# EAGLE design SparkFun_Serial_DB9-Breakout-v13 (EAGLE 7.2.0)
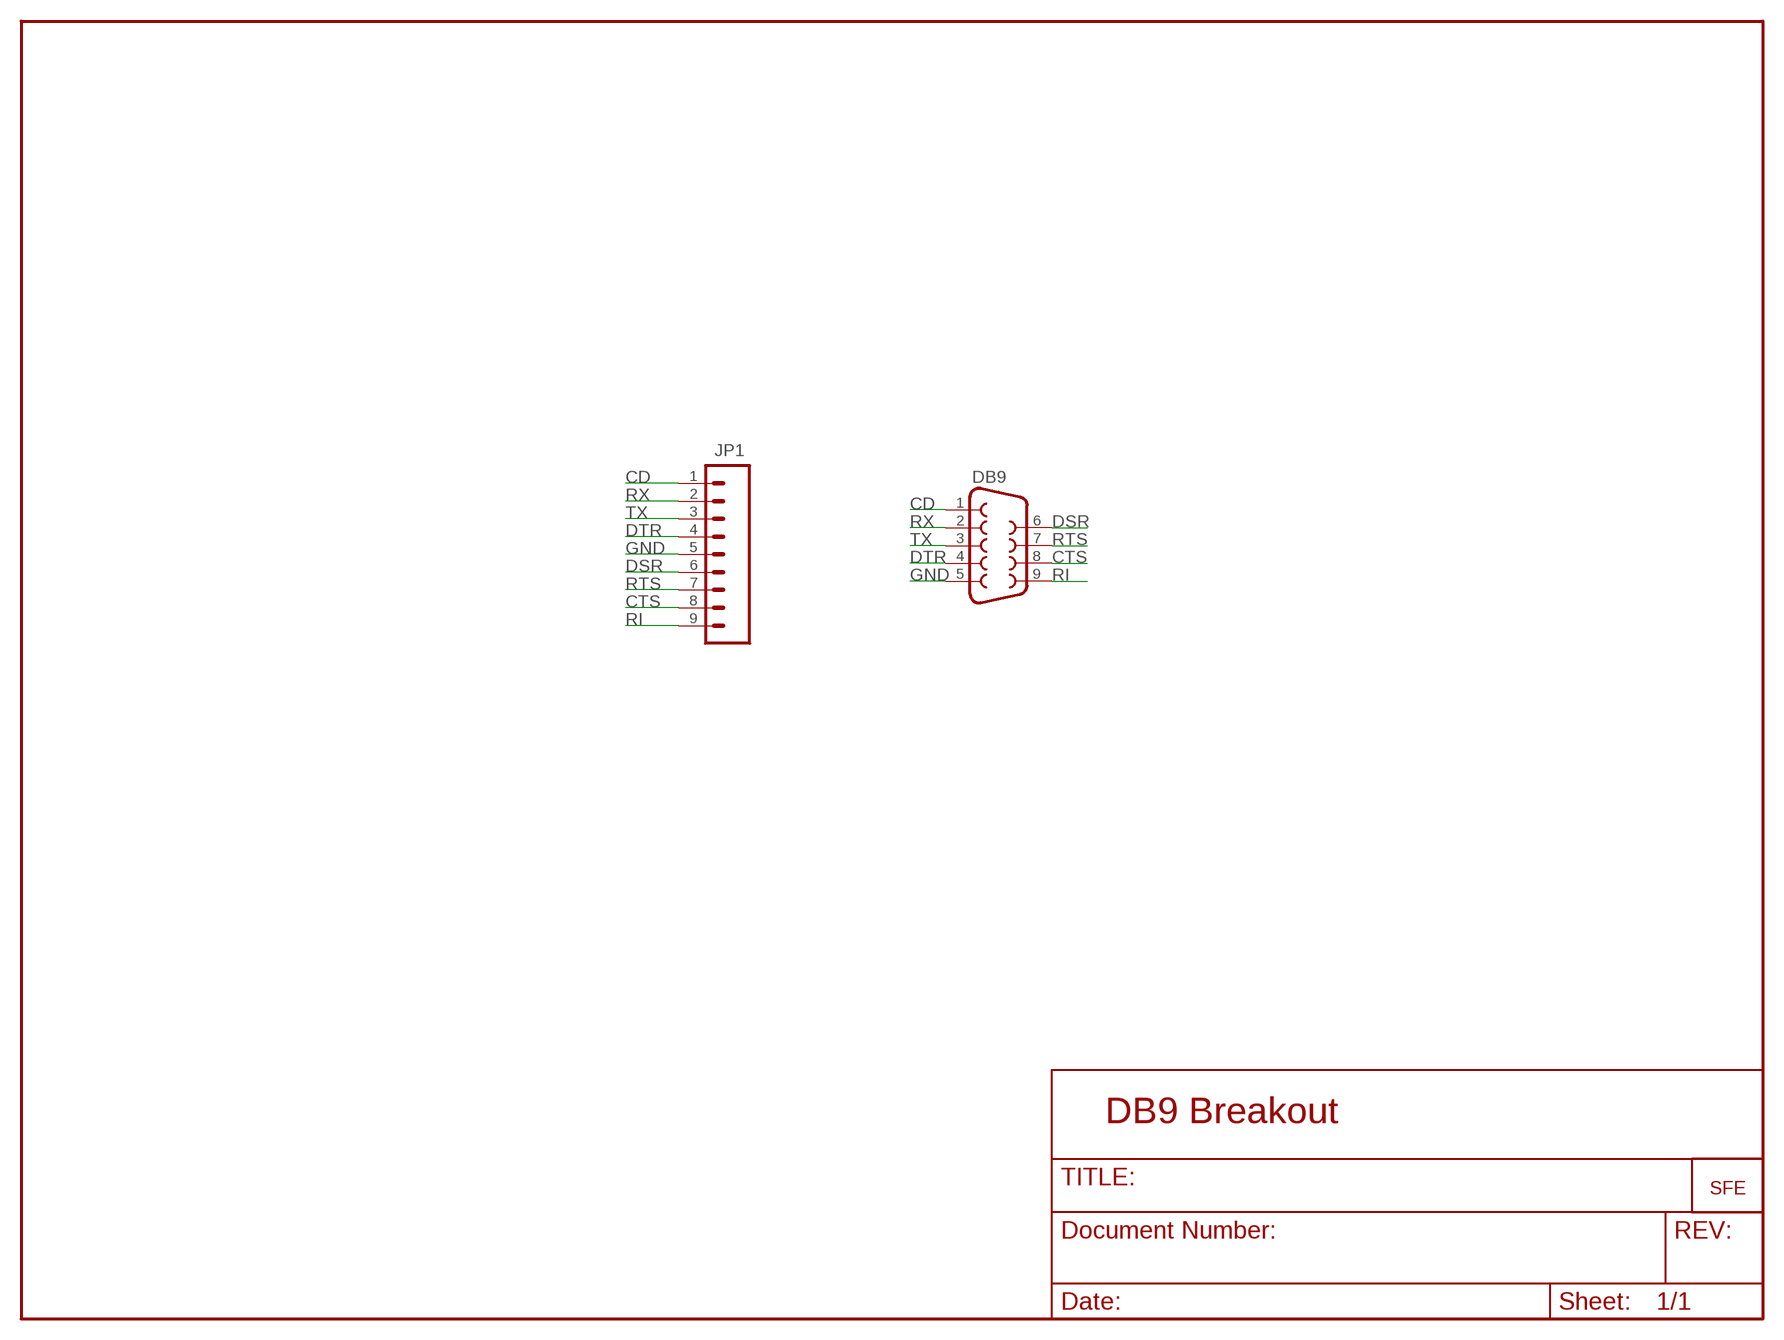
[diagram p0: schematic, sheet 1]

## Parts
DB9  DB9  [DB9]
JP1  M09  [1X09]
U$2  LOGO-SFENEW  [SFE-NEW-WEBLOGO]

## Nets
CD: DB9.1 JP1.1
CTS: DB9.8 JP1.8
DSR: DB9.6 JP1.6
DTR: DB9.4 JP1.4
GND: DB9.5 JP1.5
RI: DB9.9 JP1.9
RTS: DB9.7 JP1.7
RX: DB9.2 JP1.2
TX: DB9.3 JP1.3

## Notes on the sheet
- DB9 Breakout

## Library data of the parts
DB9 = SparkFun:DB9: DB9 Connector Standard DB9 (D-Sub 9) serial connector. Can be used for CAN bus as well as RS485 and RS232. Footprint production proven. Spark Fun Electronics SKU : PRT-00429
JP1 = SparkFun:M09: Header 9 Standard 9-pin 0.1" header. Use with straight break away headers (SKU : PRT-00116), right angle break away headers (PRT-00553), swiss pins (PRT-00743), machine pins (PRT-00117), and female headers (PRT-00115).
U$2 = SparkFun:LOGO-SFE: Spark Fun Electronics PCB Logo This is the standard Spark Fun Electronics PCB logo.

## Board
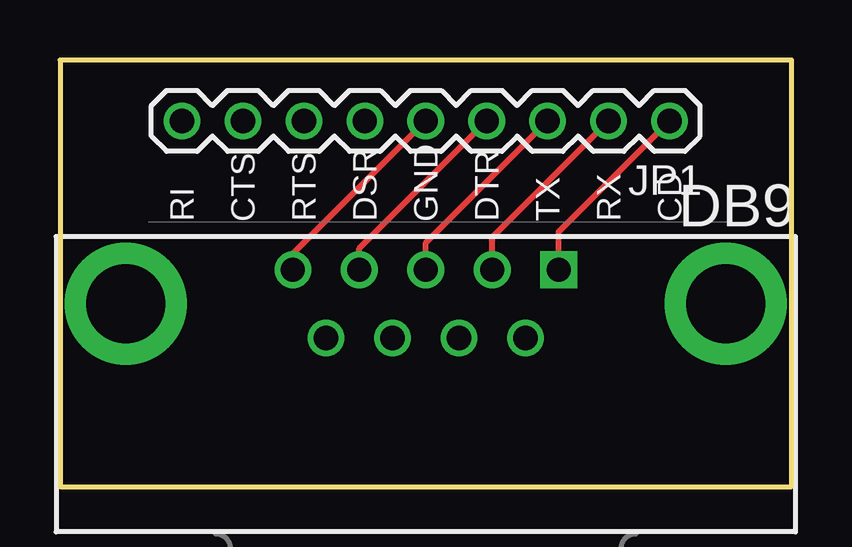
[diagram p1: board, top side]
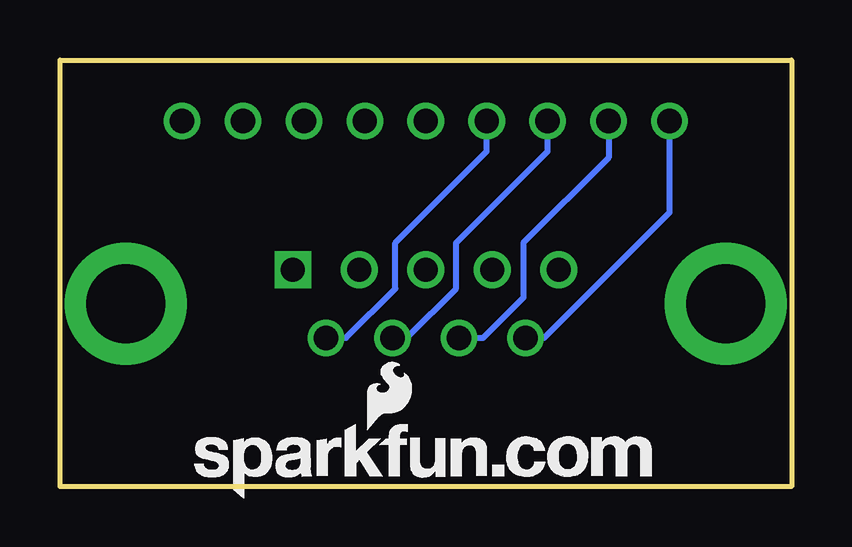
[diagram p2: board, bottom side, seen from below]

Size 30.48 x 17.78 mm. Coordinates in mm from the lower left corner, seen from the top.
Outline: 0,0 30.48,0 30.48,17.78 0,17.78 0,0
Copper layers (1*16): Top 0.035mm / dielectric 1.5mm / Bottom 0.035mm
Design rules "default": minimum track width 8mil, minimum drill 20mil, track to track 8mil, track to pad 8mil, pad to pad 8mil, via to via 8mil, smd to smd 8mil, copper to edge 40mil, drill to drill 8mil, minimum pad ring 10mil, minimum via ring 8mil, stop-mask expansion 4mil, vias tented up to drill 0mil, thermal gap 10mil

### Footprints (pad centres in the part's own frame; a part is rotated, then mirrored left to right if it is on the bottom)
DB9 = drill 1.016 square: 1 -5.54,-1.42 | drill 1.016: 2 -2.77,-1.42; 3 0,-1.42; 4 2.77,-1.42; 5 5.54,-1.42; 6 -4.15,1.42; 7 -1.38,1.42; 8 1.38,1.42; 9 4.15,1.42 | drill 3.302 pad 5.08: G1 -12.5,0; G2 12.5,0
1X09 = drill 1.016: 1 0,0; 2 2.54,0; 3 5.08,0; 4 7.62,0; 5 10.16,0; 6 12.7,0; 7 15.24,0; 8 17.78,0; 9 20.32,0

### Placement (x,y rotation side)
DB9  15.24,7.62 180 top
JP1  25.4,15.24 180 top
U$2  24.89,-0.51 0 bottom

### Tracks (layer width: path | path; a pad name or v marks a point on that pad's centre or on a via)
CD
  Top 0.254: DB9.1 20.78,10.62 JP1.1
CTS
  Bottom 0.254: DB9.8 12.85,6.2 11.18,7.87 11.18,10.16 7.62,13.72 JP1.8
DSR
  Bottom 0.254: JP1.6 12.7,13.97 16.51,10.16 16.51,8.26 18.57,6.2 DB9.6
DTR
  Top 0.254: DB9.4 12.47,9.93 JP1.4
GND
  Top 0.254: DB9.5 9.7,9.7 JP1.5
RI
  Bottom 0.254: DB9.9 10.31,6.2 5.08,11.43 JP1.9
RTS
  Bottom 0.254: JP1.7 10.16,13.97 13.97,10.16 13.97,8.26 16.02,6.2 DB9.7
RX
  Top 0.254: DB9.2 18.01,10.39 JP1.2
TX
  Top 0.254: DB9.3 15.24,10.16 JP1.3

### Text on the board
tPlace: RI | CTS | RTS | DSR | GND | DTR | TX | RX | CD